# EasyEDA schematic Lipo_Charger_5v.json
TITLE: LiPo Charger 5V; REV: 1.0; Date: 2025-10-07; Sheet: 1/1
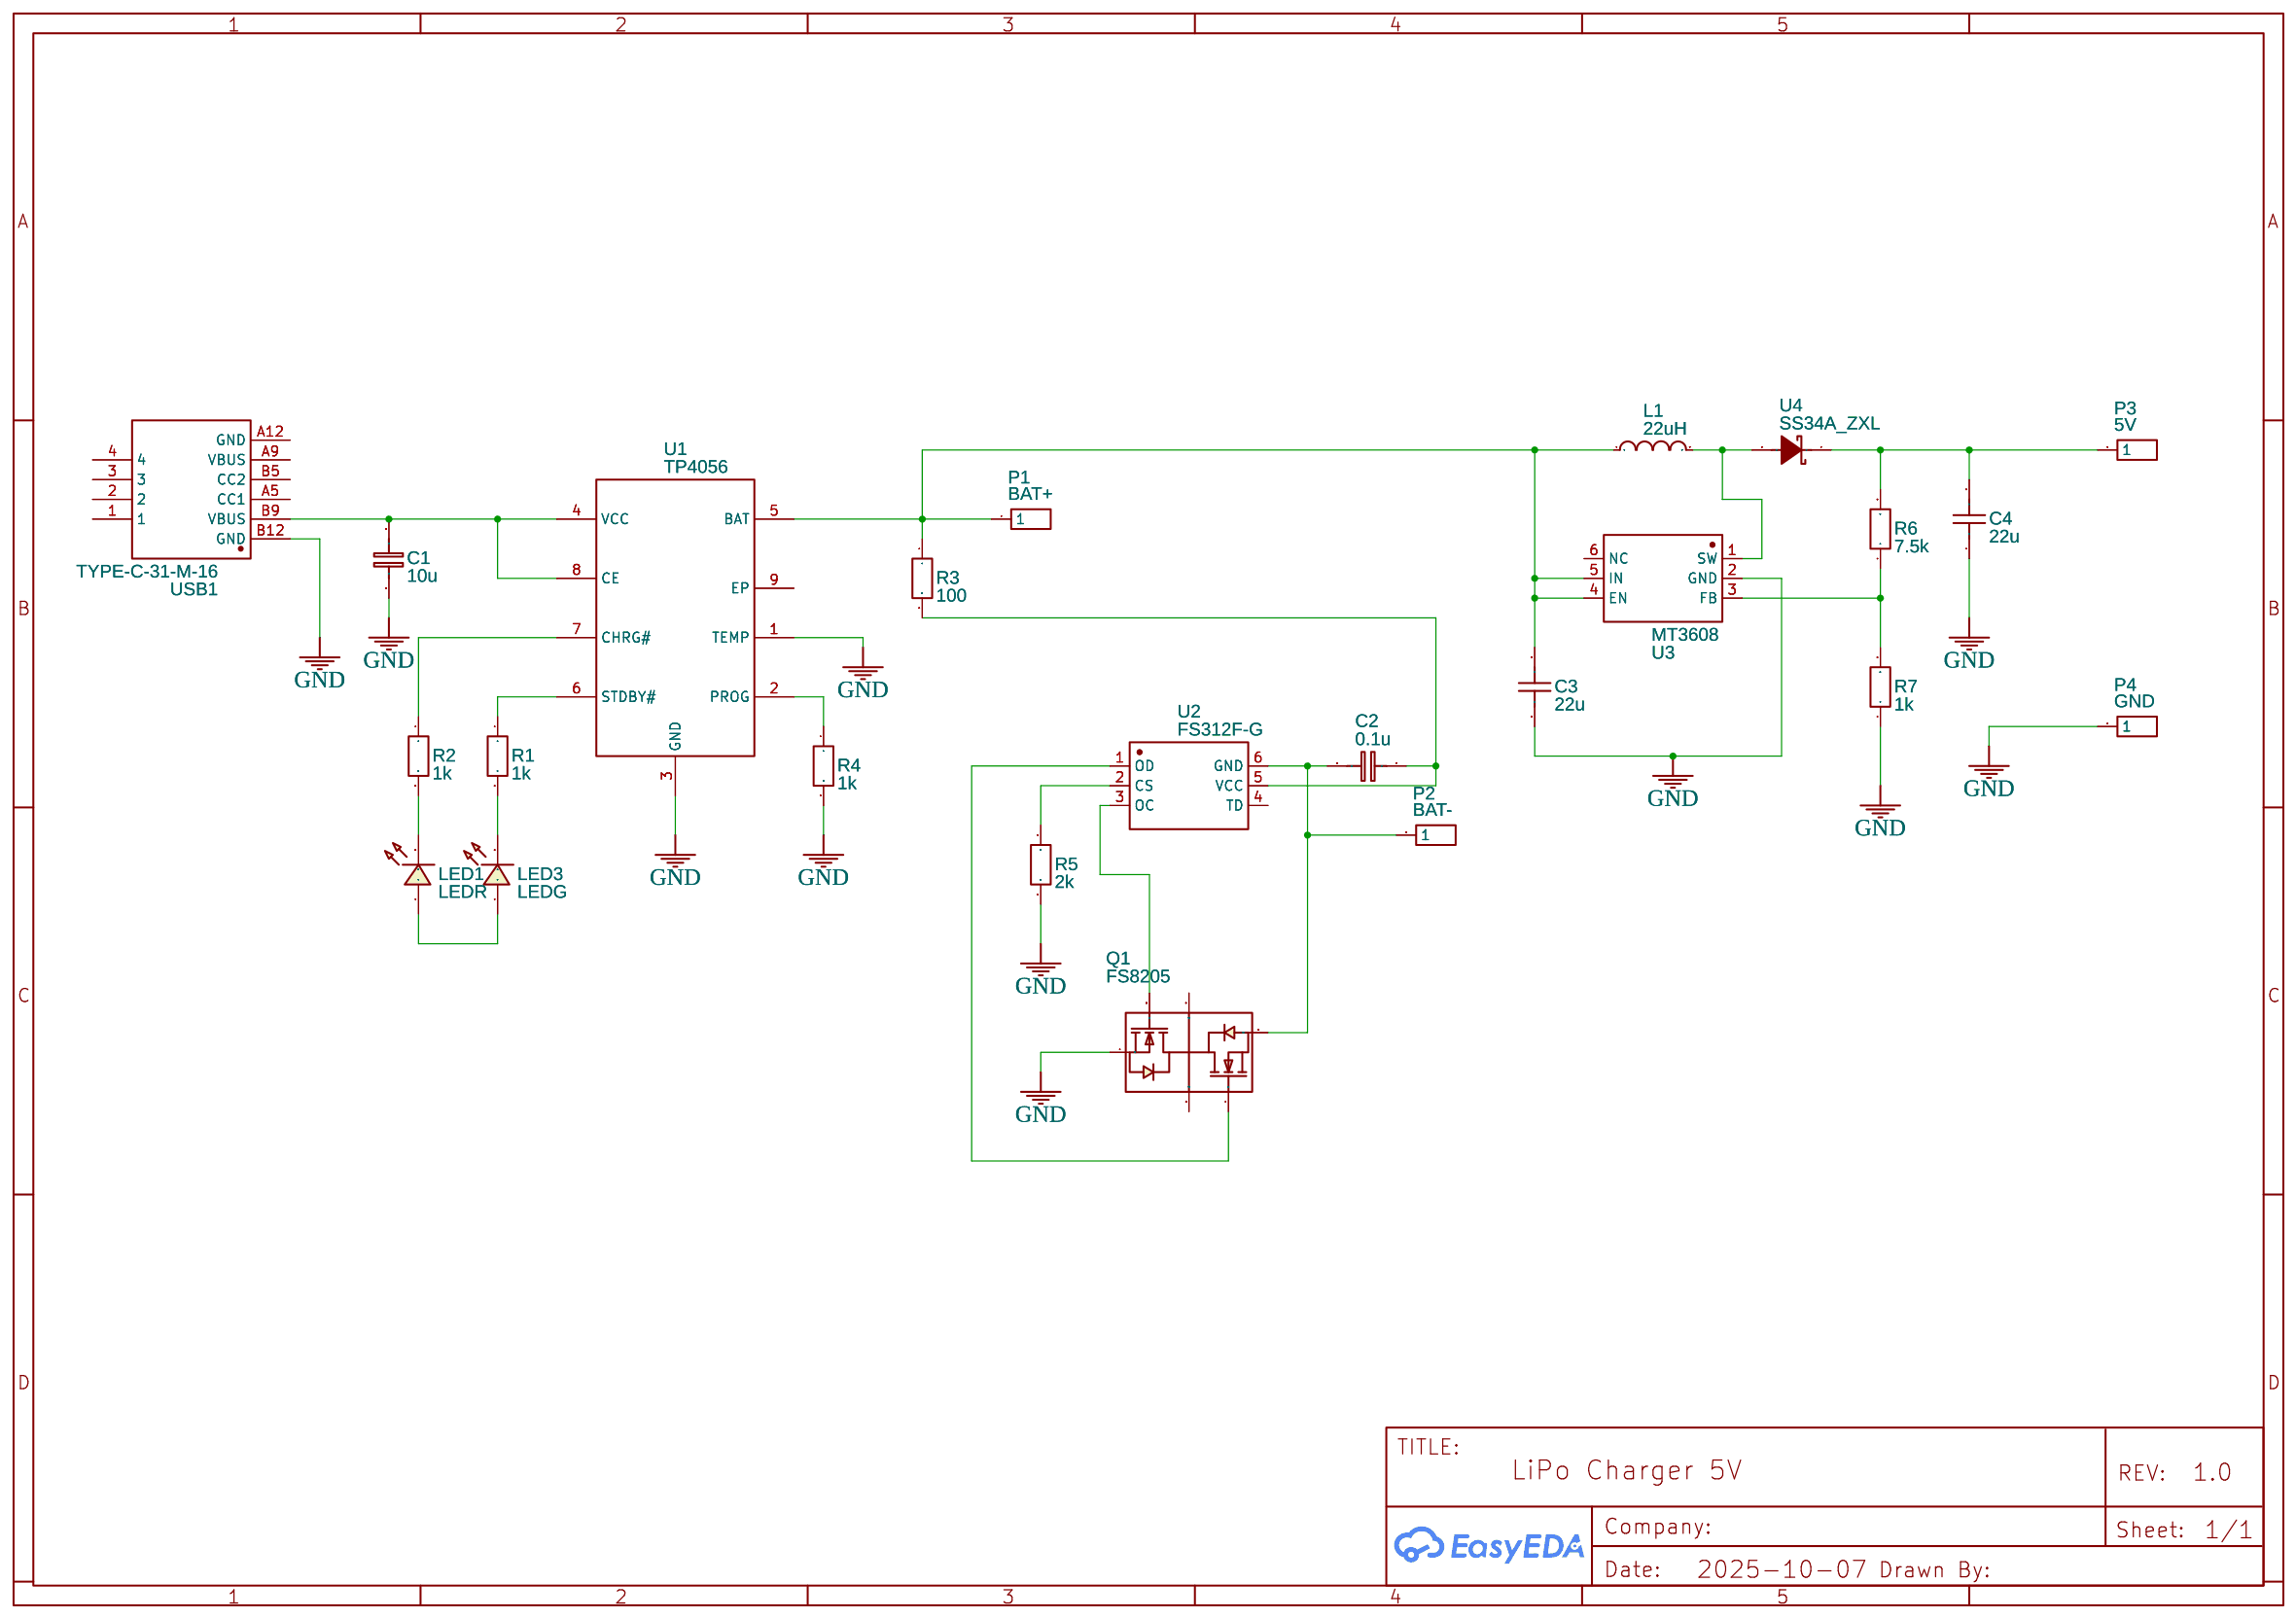
[diagram p0: schematic sheet]

## Parts
C1  10u  [C0603]
C2  0.1u  [C0603]
C3  22u  [C0603]
C4  22u  [C0603]
L1  22uH  [L0603]
LED1  LEDR  [LED0603_RED]
LED3  LEDG  [LED0603_GREEN]
P1  BAT+  [HDR-TH_1P-P2.54-V-M]
P2  BAT-  [HDR-TH_1P-P2.54-V-M]
P3  5V  [HDR-TH_1P-P2.54-V-M]
P4  GND  [HDR-TH_1P-P2.54-V-M]
Q1  FS8205  [SOT-23-6_L2.9-W1.6-P0.95-LS2.8-BR]
R1  1k  [R0603]
R2  1k  [R0603]
R3  100  [R0603]
R4  1k  [R0603]
R5  2k  [R0603]
R6  7.5k  [R0603]
R7  1k  [R0603]
U1  TP4056  [ESOP-8_L4.9-W3.9-P1.27-LS6.0-BL-EP]
U2  FS312F-G  [SOT-23-6_L2.9-W1.6-P0.95-LS2.8-BR]
U3  MT3608  [SOT-23-6_L2.9-W1.6-P0.95-LS2.8-BL]
U4  SS34A_ZXL  [DO-214AC_L4.3-W2.7-LS5.2-RD]
USB1  TYPE-C-31-M-16  [TYPE-C-SMD_TYPE-C-31-M-16]

## Library data of the parts
C1 C2 = C_0603_EU: Contributor: LCEDA_Lib
C3 C4 = C_0603_US: Contributor: LCEDA_Lib
L1 = L0603_US: Contributor: LCEDA_Lib
LED1 = LED-0603_R: Manufacturer: EVERLIGHT(台湾亿光); Manufacturer Part: 19-217/R6C-AL1M2VY/3T; Supplier Part: C72044; Supplier: LCSC; Contributor: LCEDA_01
LED3 = LED-0603_G: Manufacturer: EVERLIGHT(台湾亿光); Manufacturer Part: 19-217/GHC-YR1S2/3T; Supplier Part: C72043; Supplier: LCSC; Contributor: LCEDA_Lib
P1-P4 = Header-Male-2.54_1x1: Supplier: LCSC; Manufacturer: BOOMELE(博穆精密); Manufacturer Part: 2.54-1*1P针; Supplier Part: C81276; JLCPCB Part Class: Extended Part
Q1 = FS8205: Supplier: LCSC; Manufacturer: FORTUNE(富晶); Supplier Part: C32254; JLCPCB Part Class: Extended Part
R1-R7 = R_0603_EU: Contributor: LCEDA_Lib
U1 = TP4056: Contributor: Guest; Supplier: LCSC; Manufacturer: TOPPOWER(南京拓微); Manufacturer Part: TP4056-42-ESOP8; Supplier Part: C16581; JLCPCB Part Class: Extended Part
U2 = FS312F-G: Supplier: LCSC; Manufacturer: FORTUNE(富晶); Supplier Part: C82736; JLCPCB Part Class: Extended Part
U3 = MT3608: Supplier: LCSC; Manufacturer: 西安航天民芯; Supplier Part: C84817; JLCPCB Part Class: Extended Part
U4 = SS34A_ZXL: Supplier: LCSC; Supplier Part: C19272196; Manufacturer: Zhengxin(正芯); Manufacturer Part: SS34A; Contributor: lcsc
USB1 = TYPE-C-31-M-16: Contributor: LCSC; Supplier: LCSC; Supplier Part: C283541; Manufacturer: 韩国韩荣; JLCPCB Part Class: Extended Part

## Nets
GND: C1.1 C3.1 C4.1 P4.1 Q1.1(S1) R4.2 R5.2 R7.1 U1.1(TEMP) U1.3(GND) U3.2(GND) USB1.B12(GND)
Net-(C1-2): C1.2 U1.4(VCC) U1.8(CE) USB1.B9(VBUS)
Net-(C2-1): C2.1 R3.2 U2.5(VCC)
Net-(C2-2): C2.2 P2.1 Q1.3(S2) U2.6(GND)
Net-(C3-2): C3.2 L1.1 P1.1 R3.1 U1.5(BAT) U3.4(EN) U3.5(IN)
Net-(C4-2): C4.2 P3.1 R6.2 U4.1(K)
Net-(L1-2): L1.2 U3.1(SW) U4.2(A)
Net-(LED1-1): LED1.1 LED3.1
Net-(LED1-2): LED1.2 R2.2
Net-(LED3-2): LED3.2 R1.2
Net-(Q1-4): Q1.4(G2) U2.1(OD)
Net-(Q1-6): Q1.6(G1) U2.3(OC)
Net-(R1-1): R1.1 U1.6(STDBY#)
Net-(R2-1): R2.1 U1.7(CHRG#)
Net-(R4-1): R4.1 U1.2(PROG)
Net-(R5-1): R5.1 U2.2(CS)
Net-(R6-1): R6.1 R7.2 U3.3(FB)

Not connected (* = marked no-connect by the designer): Q1 2(D12) 5(D12); U1 9(EP); U2 4(TD); U3 6(NC); USB1 1 2 3 4 A5(CC1) A9(VBUS) A12(GND) B5(CC2)
